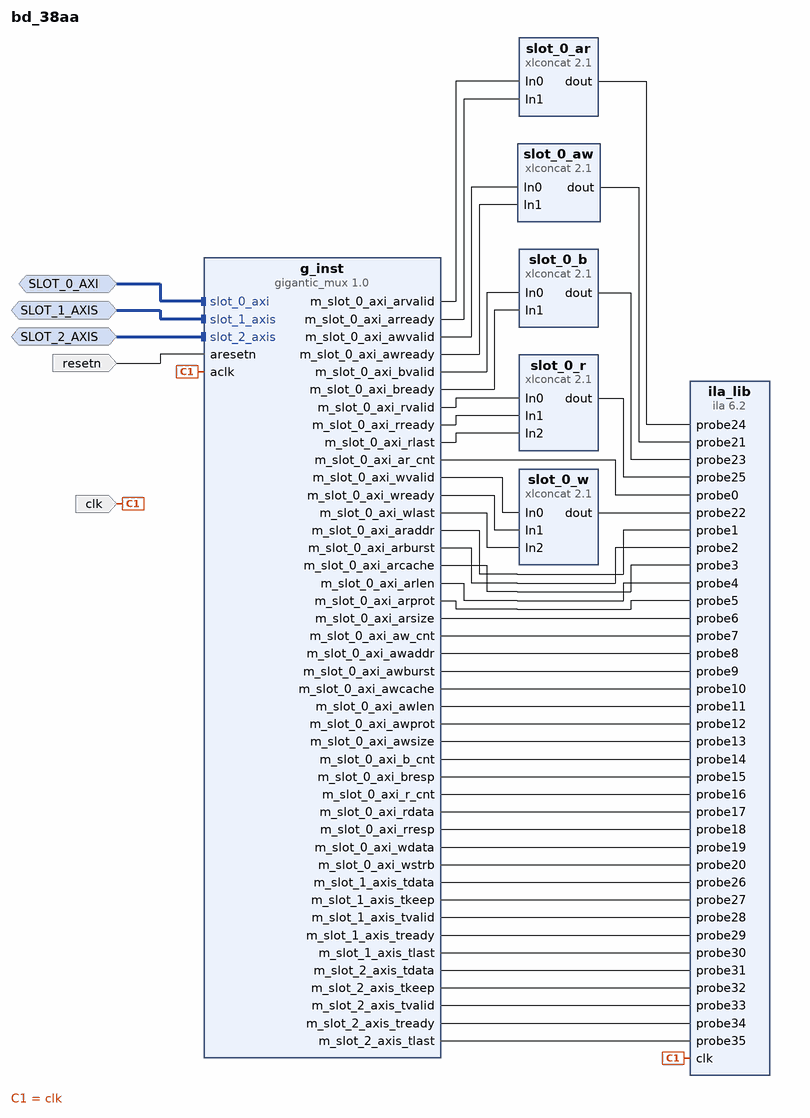
[diagram p0: block diagram of the top level]
# Vivado block design bd_38aa, xc7k70tfbg676-1, Vivado 2018.2
create_bd_design bd_38aa

create_bd_intf_port -mode Monitor -vlnv xilinx.com:interface:aximm_rtl:1.0 SLOT_0_AXI
create_bd_intf_port -mode Monitor -vlnv xilinx.com:interface:axis_rtl:1.0 SLOT_1_AXIS
create_bd_intf_port -mode Monitor -vlnv xilinx.com:interface:axis_rtl:1.0 SLOT_2_AXIS
create_bd_port -dir I -type clk clk
set_property -dict {CONFIG.ASSOCIATED_BUSIF SLOT_0_AXI:SLOT_1_AXIS:SLOT_2_AXIS CONFIG.ASSOCIATED_RESET resetn} [get_bd_ports clk]
create_bd_port -dir I -type rst resetn

create_bd_cell -type ip -vlnv xilinx.com:ip:ila:6.2 ila_lib
set_property -dict [list \
  CONFIG.C_PROBE35_TYPE 0 \
  CONFIG.C_PROBE34_TYPE 0 \
  CONFIG.C_PROBE33_TYPE 0 \
  CONFIG.C_PROBE32_TYPE 0 \
  CONFIG.C_PROBE31_TYPE 0 \
  CONFIG.C_PROBE30_TYPE 0 \
  CONFIG.C_PROBE29_TYPE 0 \
  CONFIG.C_PROBE28_TYPE 0 \
  CONFIG.C_PROBE27_TYPE 0 \
  CONFIG.C_PROBE26_TYPE 0 \
  CONFIG.C_PROBE25_TYPE 0 \
  CONFIG.C_PROBE24_TYPE 0 \
  CONFIG.C_PROBE23_TYPE 0 \
  CONFIG.C_PROBE22_TYPE 0 \
  CONFIG.C_PROBE21_TYPE 0 \
  CONFIG.C_PROBE20_TYPE 0 \
  CONFIG.C_PROBE19_TYPE 0 \
  CONFIG.C_PROBE18_TYPE 0 \
  CONFIG.C_PROBE17_TYPE 0 \
  CONFIG.C_PROBE16_TYPE 0 \
  CONFIG.C_PROBE15_TYPE 0 \
  CONFIG.C_PROBE14_TYPE 0 \
  CONFIG.C_PROBE13_TYPE 0 \
  CONFIG.C_PROBE12_TYPE 0 \
  CONFIG.C_PROBE11_TYPE 0 \
  CONFIG.C_PROBE10_TYPE 0 \
  CONFIG.C_PROBE9_TYPE 0 \
  CONFIG.C_PROBE8_TYPE 0 \
  CONFIG.C_PROBE7_TYPE 0 \
  CONFIG.C_PROBE6_TYPE 0 \
  CONFIG.C_PROBE5_TYPE 0 \
  CONFIG.C_PROBE4_TYPE 0 \
  CONFIG.C_PROBE3_TYPE 0 \
  CONFIG.C_PROBE2_TYPE 0 \
  CONFIG.C_PROBE1_TYPE 0 \
  CONFIG.C_PROBE0_TYPE 0 \
  CONFIG.C_PROBE35_WIDTH 1 \
  CONFIG.C_PROBE34_WIDTH 1 \
  CONFIG.C_PROBE33_WIDTH 1 \
  CONFIG.C_PROBE32_WIDTH 4 \
  CONFIG.C_PROBE31_WIDTH 32 \
  CONFIG.C_PROBE30_WIDTH 1 \
  CONFIG.C_PROBE29_WIDTH 1 \
  CONFIG.C_PROBE28_WIDTH 1 \
  CONFIG.C_PROBE27_WIDTH 4 \
  CONFIG.C_PROBE26_WIDTH 32 \
  CONFIG.C_PROBE25_WIDTH 3 \
  CONFIG.C_PROBE24_WIDTH 2 \
  CONFIG.C_PROBE23_WIDTH 2 \
  CONFIG.C_PROBE22_WIDTH 3 \
  CONFIG.C_PROBE21_WIDTH 2 \
  CONFIG.C_PROBE20_WIDTH 4 \
  CONFIG.C_PROBE19_WIDTH 32 \
  CONFIG.C_PROBE18_WIDTH 2 \
  CONFIG.C_PROBE17_WIDTH 32 \
  CONFIG.C_PROBE16_WIDTH 2 \
  CONFIG.C_PROBE15_WIDTH 2 \
  CONFIG.C_PROBE14_WIDTH 2 \
  CONFIG.C_PROBE13_WIDTH 3 \
  CONFIG.C_PROBE12_WIDTH 3 \
  CONFIG.C_PROBE11_WIDTH 8 \
  CONFIG.C_PROBE10_WIDTH 4 \
  CONFIG.C_PROBE9_WIDTH 2 \
  CONFIG.C_PROBE8_WIDTH 32 \
  CONFIG.C_PROBE7_WIDTH 2 \
  CONFIG.C_PROBE6_WIDTH 3 \
  CONFIG.C_PROBE5_WIDTH 3 \
  CONFIG.C_PROBE4_WIDTH 8 \
  CONFIG.C_PROBE3_WIDTH 4 \
  CONFIG.C_PROBE2_WIDTH 2 \
  CONFIG.C_PROBE1_WIDTH 32 \
  CONFIG.C_PROBE0_WIDTH 2 \
  CONFIG.C_DATA_DEPTH 2048 \
  CONFIG.C_NUM_OF_PROBES 36 \
  CONFIG.C_XLNX_HW_PROBE_INFO DEFAULT \
  CONFIG.C_TRIGOUT_EN false \
  CONFIG.C_EN_STRG_QUAL 1 \
  CONFIG.C_EN_TIME_TAG 0 \
  CONFIG.C_INPUT_PIPE_STAGES 0 \
  CONFIG.C_ILA_CLK_FREQ 100000000 \
  CONFIG.C_ADV_TRIGGER true \
  CONFIG.C_TRIGIN_EN false \
  CONFIG.ALL_PROBE_SAME_MU TRUE \
  CONFIG.ALL_PROBE_SAME_MU_CNT 4 \
  CONFIG.C_MONITOR_TYPE Native \
] [get_bd_cells ila_lib]
create_bd_cell -type ip -vlnv xilinx.com:ip:gigantic_mux:1.0 g_inst
set_property -dict [list \
  CONFIG.C_SLOT_0_TXN_CNTR_EN 1 \
  CONFIG.C_SLOT_0_MAX_RD_BURSTS 1 \
  CONFIG.C_SLOT_0_MAX_WR_BURSTS 1 \
  CONFIG.C_SLOT_2_HAS_TREADY 1 \
  CONFIG.C_SLOT_1_HAS_TREADY 1 \
  CONFIG.C_SLOT_2_HAS_TSTRB 0 \
  CONFIG.C_SLOT_2_HAS_TKEEP 1 \
  CONFIG.C_SLOT_1_HAS_TSTRB 0 \
  CONFIG.C_SLOT_1_HAS_TKEEP 1 \
  CONFIG.C_SLOT_0_HAS_BRESP 1 \
  CONFIG.C_SLOT_0_HAS_RRESP 1 \
  CONFIG.C_SLOT_0_HAS_PROT 1 \
  CONFIG.C_SLOT_0_HAS_LOCK 0 \
  CONFIG.C_SLOT_0_HAS_REGION 0 \
  CONFIG.C_SLOT_0_HAS_QOS 0 \
  CONFIG.C_SLOT_0_HAS_CACHE 1 \
  CONFIG.C_SLOT_0_HAS_WSTRB 1 \
  CONFIG.C_SLOT_0_HAS_BURST 1 \
  CONFIG.C_SLOT_0_AXI_AXLEN_WIDTH 8 \
  CONFIG.C_SLOT_0_AXI_AXLOCK_WIDTH 1 \
  CONFIG.C_SLOT_0_AXI_AWUSER_WIDTH 0 \
  CONFIG.C_SLOT_0_AXI_WUSER_WIDTH 0 \
  CONFIG.C_SLOT_0_AXI_BUSER_WIDTH 0 \
  CONFIG.C_SLOT_0_AXI_ARUSER_WIDTH 0 \
  CONFIG.C_SLOT_0_AXI_RUSER_WIDTH 0 \
  CONFIG.C_SLOT_2_AXIS_TUSER_WIDTH 0 \
  CONFIG.C_SLOT_2_AXIS_TDEST_WIDTH 0 \
  CONFIG.C_SLOT_2_AXIS_TID_WIDTH 0 \
  CONFIG.C_SLOT_2_AXIS_TDATA_WIDTH 32 \
  CONFIG.C_SLOT_2_AXI_PROTOCOL AXI4S \
  CONFIG.C_SLOT_1_AXIS_TUSER_WIDTH 0 \
  CONFIG.C_SLOT_1_AXIS_TDEST_WIDTH 0 \
  CONFIG.C_SLOT_1_AXIS_TID_WIDTH 0 \
  CONFIG.C_SLOT_1_AXIS_TDATA_WIDTH 8 \
  CONFIG.C_SLOT_1_AXI_PROTOCOL AXI4S \
  CONFIG.C_SLOT_0_AXI_PROTOCOL AXI4 \
  CONFIG.C_SLOT_0_AXI_ID_WIDTH 0 \
  CONFIG.C_SLOT_0_AXI_DATA_WIDTH 32 \
  CONFIG.C_SLOT_0_AXI_ADDR_WIDTH 32 \
  CONFIG.C_NUM_OF_PROBES 0 \
  CONFIG.C_NUM_MONITOR_SLOTS 3 \
  CONFIG.C_SLOT_0_MON_MODE FT \
  CONFIG.C_SLOT_1_MON_MODE FT \
  CONFIG.C_SLOT_2_MON_MODE FT \
  CONFIG.C_EN_GIGAMUX false \
  CONFIG.C_SLOT_0_AXI_AW_SEL 1 \
  CONFIG.C_SLOT_0_AXI_W_SEL 1 \
  CONFIG.C_SLOT_0_AXI_B_SEL 1 \
  CONFIG.C_SLOT_0_AXI_AR_SEL 1 \
  CONFIG.C_SLOT_0_AXI_R_SEL 1 \
] [get_bd_cells g_inst]
create_bd_cell -type ip -vlnv xilinx.com:ip:xlconcat:2.1 slot_0_aw
create_bd_cell -type ip -vlnv xilinx.com:ip:xlconcat:2.1 slot_0_w
set_property -dict {CONFIG.NUM_PORTS 3} [get_bd_cells slot_0_w]
create_bd_cell -type ip -vlnv xilinx.com:ip:xlconcat:2.1 slot_0_b
create_bd_cell -type ip -vlnv xilinx.com:ip:xlconcat:2.1 slot_0_ar
create_bd_cell -type ip -vlnv xilinx.com:ip:xlconcat:2.1 slot_0_r
set_property -dict {CONFIG.NUM_PORTS 3} [get_bd_cells slot_0_r]

# ---- connections ----

connect_bd_intf_net [get_bd_intf_ports SLOT_0_AXI] [get_bd_intf_pins g_inst/slot_0_axi]
connect_bd_intf_net [get_bd_intf_ports SLOT_1_AXIS] [get_bd_intf_pins g_inst/slot_1_axis]
connect_bd_intf_net [get_bd_intf_ports SLOT_2_AXIS] [get_bd_intf_pins g_inst/slot_2_axis]
connect_bd_net [get_bd_ports clk] [get_bd_pins ila_lib/clk] [get_bd_pins g_inst/aclk]
connect_bd_net [get_bd_ports resetn] [get_bd_pins g_inst/aresetn]
connect_bd_net -net net_slot_0_axi_ar_cnt [get_bd_pins g_inst/m_slot_0_axi_ar_cnt] [get_bd_pins ila_lib/probe0]
connect_bd_net -net net_slot_0_axi_araddr [get_bd_pins g_inst/m_slot_0_axi_araddr] [get_bd_pins ila_lib/probe1]
connect_bd_net -net net_slot_0_axi_arburst [get_bd_pins g_inst/m_slot_0_axi_arburst] [get_bd_pins ila_lib/probe2]
connect_bd_net -net net_slot_0_axi_arcache [get_bd_pins g_inst/m_slot_0_axi_arcache] [get_bd_pins ila_lib/probe3]
connect_bd_net -net net_slot_0_axi_arlen [get_bd_pins g_inst/m_slot_0_axi_arlen] [get_bd_pins ila_lib/probe4]
connect_bd_net -net net_slot_0_axi_arprot [get_bd_pins g_inst/m_slot_0_axi_arprot] [get_bd_pins ila_lib/probe5]
connect_bd_net -net net_slot_0_axi_arsize [get_bd_pins g_inst/m_slot_0_axi_arsize] [get_bd_pins ila_lib/probe6]
connect_bd_net -net net_slot_0_axi_aw_cnt [get_bd_pins g_inst/m_slot_0_axi_aw_cnt] [get_bd_pins ila_lib/probe7]
connect_bd_net -net net_slot_0_axi_awaddr [get_bd_pins g_inst/m_slot_0_axi_awaddr] [get_bd_pins ila_lib/probe8]
connect_bd_net -net net_slot_0_axi_awburst [get_bd_pins g_inst/m_slot_0_axi_awburst] [get_bd_pins ila_lib/probe9]
connect_bd_net -net net_slot_0_axi_awcache [get_bd_pins g_inst/m_slot_0_axi_awcache] [get_bd_pins ila_lib/probe10]
connect_bd_net -net net_slot_0_axi_awlen [get_bd_pins g_inst/m_slot_0_axi_awlen] [get_bd_pins ila_lib/probe11]
connect_bd_net -net net_slot_0_axi_awprot [get_bd_pins g_inst/m_slot_0_axi_awprot] [get_bd_pins ila_lib/probe12]
connect_bd_net -net net_slot_0_axi_awsize [get_bd_pins g_inst/m_slot_0_axi_awsize] [get_bd_pins ila_lib/probe13]
connect_bd_net -net net_slot_0_axi_b_cnt [get_bd_pins g_inst/m_slot_0_axi_b_cnt] [get_bd_pins ila_lib/probe14]
connect_bd_net -net net_slot_0_axi_bresp [get_bd_pins g_inst/m_slot_0_axi_bresp] [get_bd_pins ila_lib/probe15]
connect_bd_net -net net_slot_0_axi_r_cnt [get_bd_pins g_inst/m_slot_0_axi_r_cnt] [get_bd_pins ila_lib/probe16]
connect_bd_net -net net_slot_0_axi_rdata [get_bd_pins g_inst/m_slot_0_axi_rdata] [get_bd_pins ila_lib/probe17]
connect_bd_net -net net_slot_0_axi_rresp [get_bd_pins g_inst/m_slot_0_axi_rresp] [get_bd_pins ila_lib/probe18]
connect_bd_net -net net_slot_0_axi_wdata [get_bd_pins g_inst/m_slot_0_axi_wdata] [get_bd_pins ila_lib/probe19]
connect_bd_net -net net_slot_0_axi_wstrb [get_bd_pins g_inst/m_slot_0_axi_wstrb] [get_bd_pins ila_lib/probe20]
connect_bd_net -net net_slot_0_axi_aw_ctrl [get_bd_pins slot_0_aw/dout] [get_bd_pins ila_lib/probe21]
connect_bd_net -net net_slot_0_axi_awvalid [get_bd_pins g_inst/m_slot_0_axi_awvalid] [get_bd_pins slot_0_aw/In0]
connect_bd_net -net net_slot_0_axi_awready [get_bd_pins g_inst/m_slot_0_axi_awready] [get_bd_pins slot_0_aw/In1]
connect_bd_net -net net_slot_0_axi_w_ctrl [get_bd_pins slot_0_w/dout] [get_bd_pins ila_lib/probe22]
connect_bd_net -net net_slot_0_axi_wvalid [get_bd_pins g_inst/m_slot_0_axi_wvalid] [get_bd_pins slot_0_w/In0]
connect_bd_net -net net_slot_0_axi_wready [get_bd_pins g_inst/m_slot_0_axi_wready] [get_bd_pins slot_0_w/In1]
connect_bd_net -net net_slot_0_axi_wlast [get_bd_pins g_inst/m_slot_0_axi_wlast] [get_bd_pins slot_0_w/In2]
connect_bd_net -net net_slot_0_axi_b_ctrl [get_bd_pins slot_0_b/dout] [get_bd_pins ila_lib/probe23]
connect_bd_net -net net_slot_0_axi_bvalid [get_bd_pins g_inst/m_slot_0_axi_bvalid] [get_bd_pins slot_0_b/In0]
connect_bd_net -net net_slot_0_axi_bready [get_bd_pins g_inst/m_slot_0_axi_bready] [get_bd_pins slot_0_b/In1]
connect_bd_net -net net_slot_0_axi_ar_ctrl [get_bd_pins slot_0_ar/dout] [get_bd_pins ila_lib/probe24]
connect_bd_net -net net_slot_0_axi_arvalid [get_bd_pins g_inst/m_slot_0_axi_arvalid] [get_bd_pins slot_0_ar/In0]
connect_bd_net -net net_slot_0_axi_arready [get_bd_pins g_inst/m_slot_0_axi_arready] [get_bd_pins slot_0_ar/In1]
connect_bd_net -net net_slot_0_axi_r_ctrl [get_bd_pins slot_0_r/dout] [get_bd_pins ila_lib/probe25]
connect_bd_net -net net_slot_0_axi_rvalid [get_bd_pins g_inst/m_slot_0_axi_rvalid] [get_bd_pins slot_0_r/In0]
connect_bd_net -net net_slot_0_axi_rready [get_bd_pins g_inst/m_slot_0_axi_rready] [get_bd_pins slot_0_r/In1]
connect_bd_net -net net_slot_0_axi_rlast [get_bd_pins g_inst/m_slot_0_axi_rlast] [get_bd_pins slot_0_r/In2]
connect_bd_net -net net_slot_1_axis_tdata [get_bd_pins g_inst/m_slot_1_axis_tdata] [get_bd_pins ila_lib/probe26]
connect_bd_net -net net_slot_1_axis_tkeep [get_bd_pins g_inst/m_slot_1_axis_tkeep] [get_bd_pins ila_lib/probe27]
connect_bd_net -net net_slot_1_axis_tvalid [get_bd_pins g_inst/m_slot_1_axis_tvalid] [get_bd_pins ila_lib/probe28]
connect_bd_net -net net_slot_1_axis_tready [get_bd_pins g_inst/m_slot_1_axis_tready] [get_bd_pins ila_lib/probe29]
connect_bd_net -net net_slot_1_axis_tlast [get_bd_pins g_inst/m_slot_1_axis_tlast] [get_bd_pins ila_lib/probe30]
connect_bd_net -net net_slot_2_axis_tdata [get_bd_pins g_inst/m_slot_2_axis_tdata] [get_bd_pins ila_lib/probe31]
connect_bd_net -net net_slot_2_axis_tkeep [get_bd_pins g_inst/m_slot_2_axis_tkeep] [get_bd_pins ila_lib/probe32]
connect_bd_net -net net_slot_2_axis_tvalid [get_bd_pins g_inst/m_slot_2_axis_tvalid] [get_bd_pins ila_lib/probe33]
connect_bd_net -net net_slot_2_axis_tready [get_bd_pins g_inst/m_slot_2_axis_tready] [get_bd_pins ila_lib/probe34]
connect_bd_net -net net_slot_2_axis_tlast [get_bd_pins g_inst/m_slot_2_axis_tlast] [get_bd_pins ila_lib/probe35]

validate_bd_design
save_bd_design
